# Altium schematic sheet DX-GP10_SCH_Part_AD.SchDoc
size A4; SheetNumber: 1; SheetTotal: 1
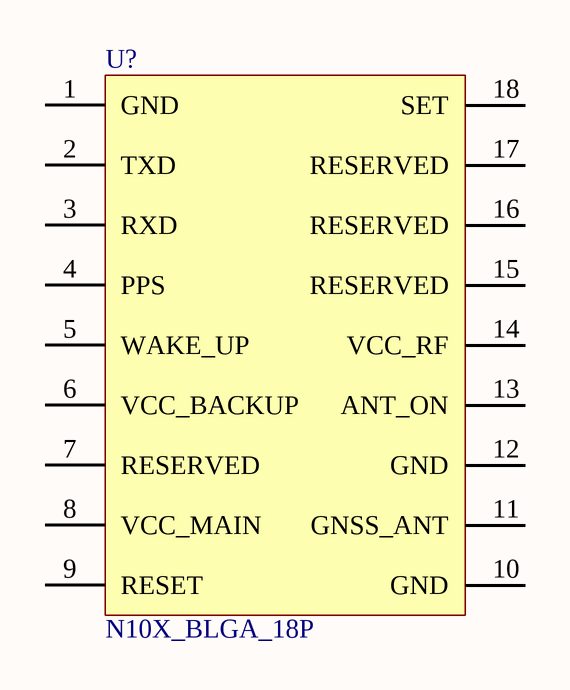
[diagram p0: DX-GP10_SCH_Part_AD.SchDoc]

## Parts
U?  N10X_BLGA_18P

## Nets

Not connected (* = marked no-connect by the designer): U? 1(GND) 2(TXD) 3(RXD) 4(PPS) 5(WAKE_UP) 6(VCC_BACKUP) 7(RESERVED) 8(VCC_MAIN) 9(RESET) 10(GND) 11(GNSS_ANT) 12(GND) 13(ANT_ON) 14(VCC_RF) 15(RESERVED) 16(RESERVED) 17(RESERVED) 18(SET)